# EAGLE schematic MotherBoard (EAGLE 8.1.0)

## Sheet 1 of 6
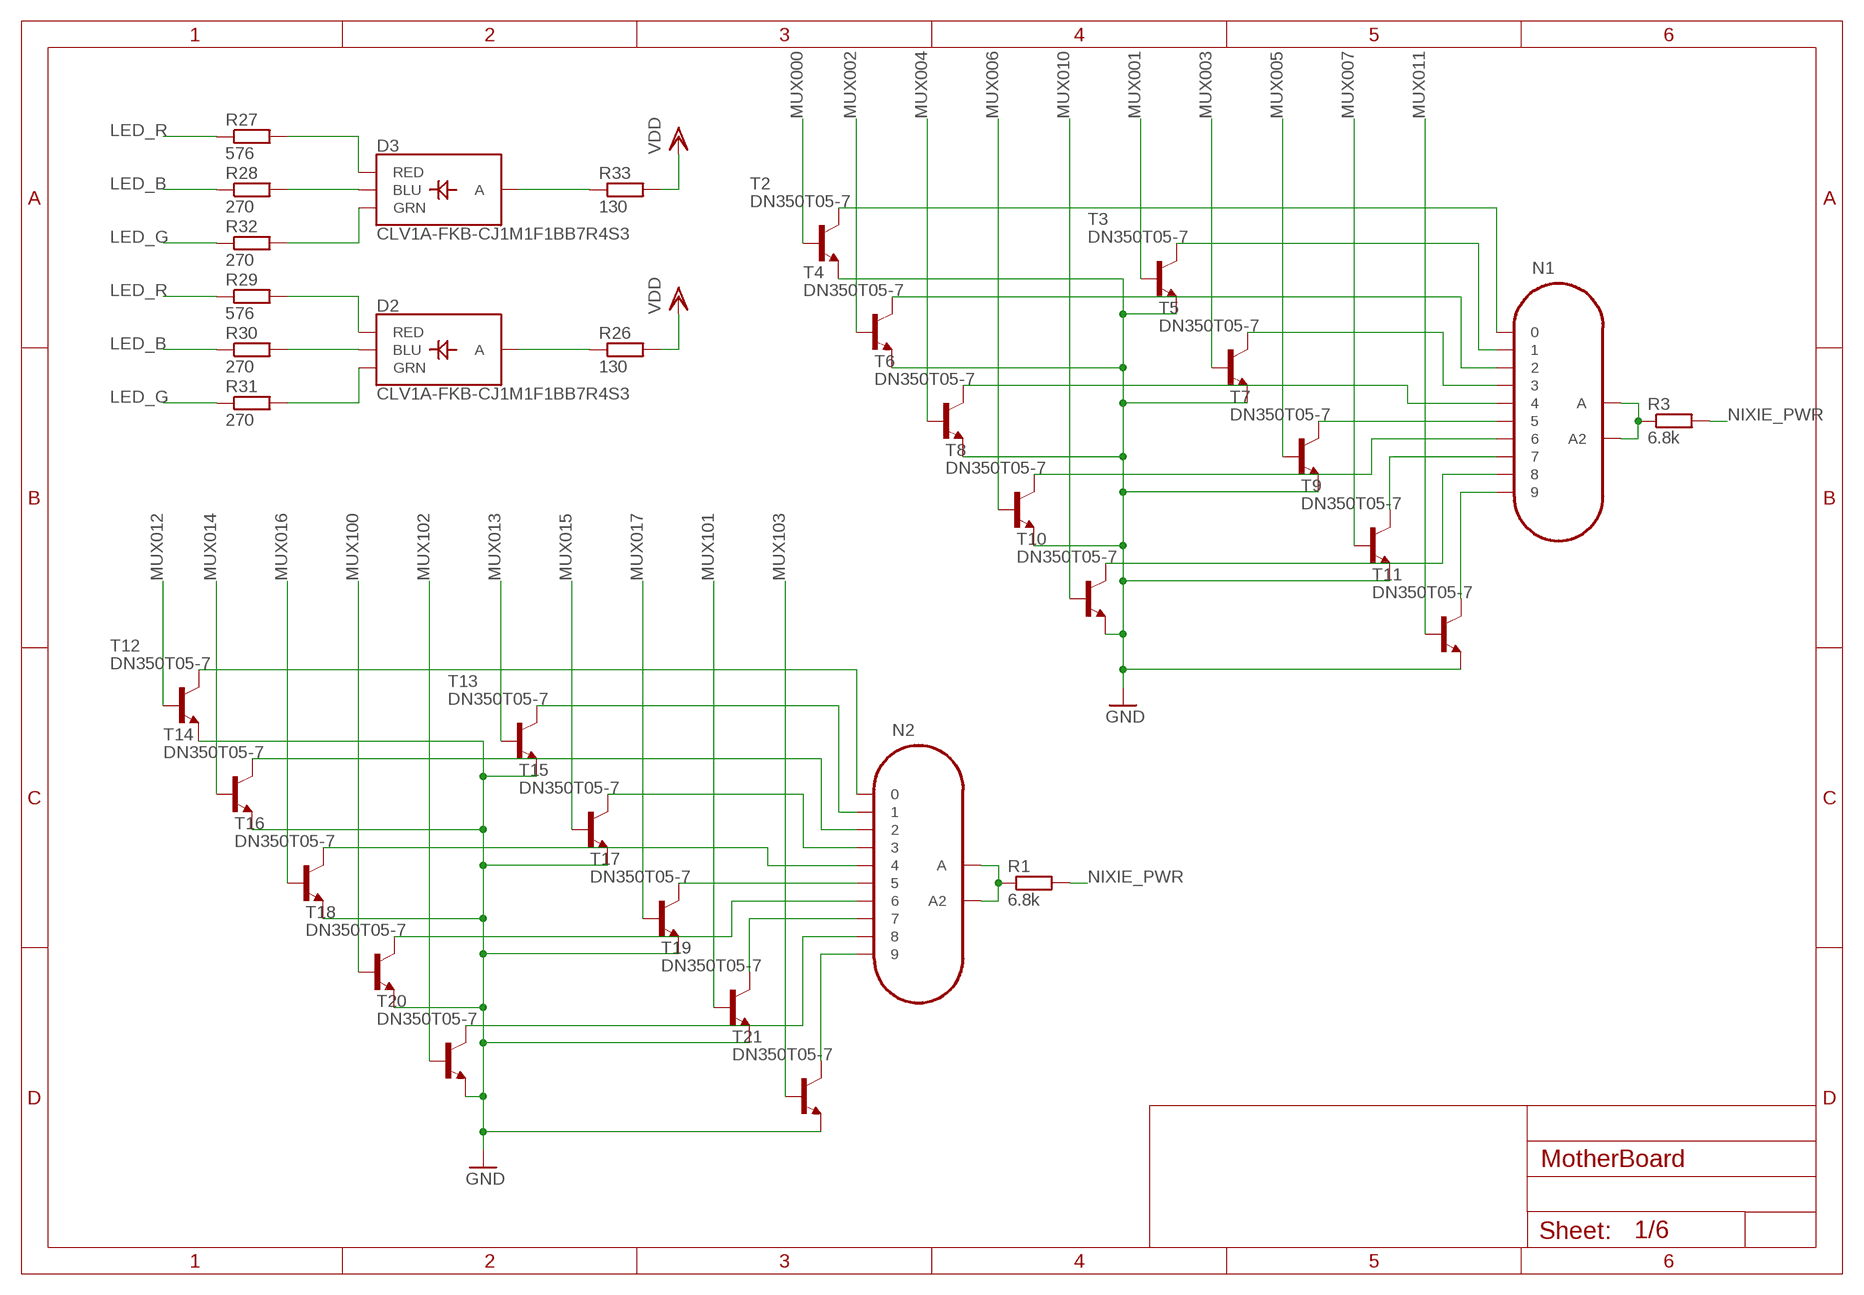
[diagram p0: schematic, sheet 1]

### Parts
D2  CLV1A-FKB-CJ1M1F1BB7R4S3  LED-RGB-CAPLCC  [P-LCC-4-3]
D3  CLV1A-FKB-CJ1M1F1BB7R4S3  LED-RGB-CAPLCC  [P-LCC-4-3]
N1  IN-18  [IN-18]
N2  IN-18  [IN-18]
R1  6.8k  R-EU_R0603  [R0603]
R3  6.8k  R-EU_R0603  [R0603]
R26  130  R-EU_R0603  [R0603]
R27  576  R-EU_R0603  [R0603]
R28  270  R-EU_R0603  [R0603]
R29  576  R-EU_R0603  [R0603]
R30  270  R-EU_R0603  [R0603]
R31  270  R-EU_R0603  [R0603]
R32  270  R-EU_R0603  [R0603]
R33  130  R-EU_R0603  [R0603]
T2  DN350T05-7  -NPN-SOT23-EBC  [SOT23-EBC]
T3  DN350T05-7  -NPN-SOT23-EBC  [SOT23-EBC]
T4  DN350T05-7  -NPN-SOT23-EBC  [SOT23-EBC]
T5  DN350T05-7  -NPN-SOT23-EBC  [SOT23-EBC]
T6  DN350T05-7  -NPN-SOT23-EBC  [SOT23-EBC]
T7  DN350T05-7  -NPN-SOT23-EBC  [SOT23-EBC]
T8  DN350T05-7  -NPN-SOT23-EBC  [SOT23-EBC]
T9  DN350T05-7  -NPN-SOT23-EBC  [SOT23-EBC]
T10  DN350T05-7  -NPN-SOT23-EBC  [SOT23-EBC]
T11  DN350T05-7  -NPN-SOT23-EBC  [SOT23-EBC]
T12  DN350T05-7  -NPN-SOT23-EBC  [SOT23-EBC]
T13  DN350T05-7  -NPN-SOT23-EBC  [SOT23-EBC]
T14  DN350T05-7  -NPN-SOT23-EBC  [SOT23-EBC]
T15  DN350T05-7  -NPN-SOT23-EBC  [SOT23-EBC]
T16  DN350T05-7  -NPN-SOT23-EBC  [SOT23-EBC]
T17  DN350T05-7  -NPN-SOT23-EBC  [SOT23-EBC]
T18  DN350T05-7  -NPN-SOT23-EBC  [SOT23-EBC]
T19  DN350T05-7  -NPN-SOT23-EBC  [SOT23-EBC]
T20  DN350T05-7  -NPN-SOT23-EBC  [SOT23-EBC]
T21  DN350T05-7  -NPN-SOT23-EBC  [SOT23-EBC]

### Nets
GND: T2.E T3.E T4.E T5.E T6.E T7.E T8.E T9.E T10.E T11.E T12.E T13.E T14.E T15.E T16.E T17.E T18.E T19.E T20.E T21.E ; also sheet 2,3,4,5,6
LED_B: R28.1 R30.1 ; also sheet 2,3,6
LED_G: R31.1 R32.1 ; also sheet 2,3,6
LED_R: R27.1 R29.1 ; also sheet 2,3,6
MUX000: T2.B ; also sheet 4
MUX001: T3.B ; also sheet 4
MUX002: T4.B ; also sheet 4
MUX003: T5.B ; also sheet 4
MUX004: T6.B ; also sheet 4
MUX005: T7.B ; also sheet 4
MUX006: T8.B ; also sheet 4
MUX007: T9.B ; also sheet 4
MUX010: T10.B ; also sheet 4
MUX011: T11.B ; also sheet 4
MUX012: T12.B ; also sheet 4
MUX013: T13.B ; also sheet 4
MUX014: T14.B ; also sheet 4
MUX015: T15.B ; also sheet 4
MUX016: T16.B ; also sheet 4
MUX017: T17.B ; also sheet 4
MUX100: T18.B ; also sheet 4
MUX101: T19.B ; also sheet 4
MUX102: T20.B ; also sheet 4
MUX103: T21.B ; also sheet 4
N$1 [HV]: N2.1 T13.C
N$2 [HV]: N2.2 T14.C
N$3 [HV]: N2.3 T15.C
N$4 [HV]: N2.4 T16.C
N$5: N1.A N1.A2 R3.1
N$6 [HV]: N1.1 T3.C
N$7 [HV]: N1.2 T4.C
N$8 [HV]: N1.3 T5.C
N$9 [HV]: N1.4 T6.C
N$10 [HV]: N1.5 T7.C
N$11 [HV]: N1.6 T8.C
N$12 [HV]: N2.5 T17.C
N$13 [HV]: N2.6 T18.C
N$14 [HV]: N1.7 T9.C
N$15 [HV]: N1.8 T10.C
N$16 [HV]: N1.9 T11.C
N$17 [HV]: N2.7 T19.C
N$18 [HV]: N2.0 T12.C
N$19 [HV]: N2.8 T20.C
N$20 [HV]: N2.9 T21.C
N$21: N2.A N2.A2 R1.1
N$24 [HV]: N1.0 T2.C
N$73: D2.4(A) R26.1
N$83: D2.1(RED) R29.2
N$84: D2.3(BLU) R30.2
N$85: D2.2(GRN) R31.2
N$86: D3.4(A) R33.1
N$87: D3.1(RED) R27.2
N$88: D3.3(BLU) R28.2
N$89: D3.2(GRN) R32.2
NIXIE_PWR: R1.2 R3.2 ; also sheet 2,3,5
VDD: R26.2 R33.2 ; also sheet 2,3,4,5,6

## Sheet 2 of 6
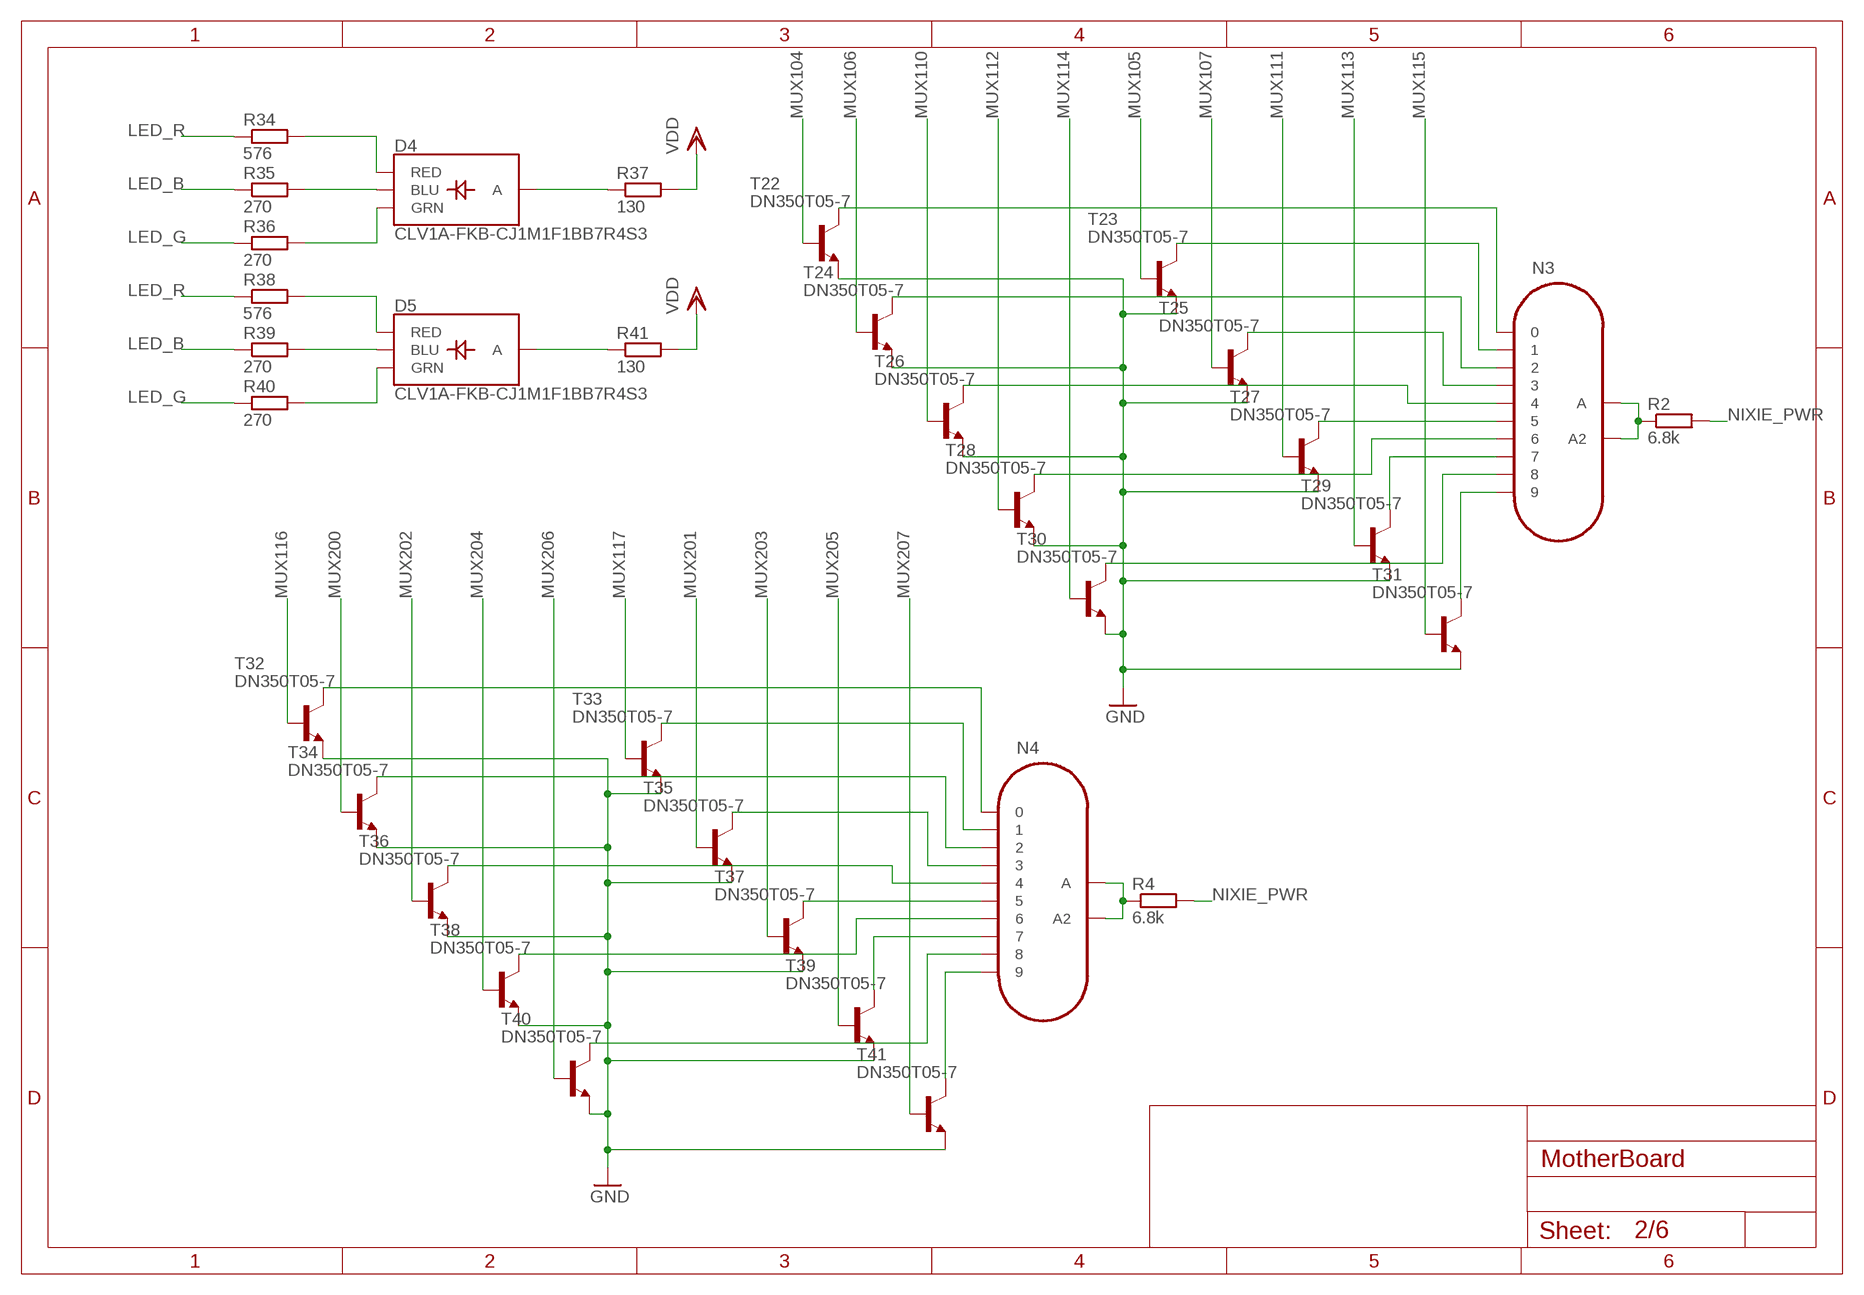
[diagram p1: schematic, sheet 2]

### Parts
D4  CLV1A-FKB-CJ1M1F1BB7R4S3  LED-RGB-CAPLCC  [P-LCC-4-3]
D5  CLV1A-FKB-CJ1M1F1BB7R4S3  LED-RGB-CAPLCC  [P-LCC-4-3]
N3  IN-18  [IN-18]
N4  IN-18  [IN-18]
R2  6.8k  R-EU_R0603  [R0603]
R4  6.8k  R-EU_R0603  [R0603]
R34  576  R-EU_R0603  [R0603]
R35  270  R-EU_R0603  [R0603]
R36  270  R-EU_R0603  [R0603]
R37  130  R-EU_R0603  [R0603]
R38  576  R-EU_R0603  [R0603]
R39  270  R-EU_R0603  [R0603]
R40  270  R-EU_R0603  [R0603]
R41  130  R-EU_R0603  [R0603]
T22  DN350T05-7  -NPN-SOT23-EBC  [SOT23-EBC]
T23  DN350T05-7  -NPN-SOT23-EBC  [SOT23-EBC]
T24  DN350T05-7  -NPN-SOT23-EBC  [SOT23-EBC]
T25  DN350T05-7  -NPN-SOT23-EBC  [SOT23-EBC]
T26  DN350T05-7  -NPN-SOT23-EBC  [SOT23-EBC]
T27  DN350T05-7  -NPN-SOT23-EBC  [SOT23-EBC]
T28  DN350T05-7  -NPN-SOT23-EBC  [SOT23-EBC]
T29  DN350T05-7  -NPN-SOT23-EBC  [SOT23-EBC]
T30  DN350T05-7  -NPN-SOT23-EBC  [SOT23-EBC]
T31  DN350T05-7  -NPN-SOT23-EBC  [SOT23-EBC]
T32  DN350T05-7  -NPN-SOT23-EBC  [SOT23-EBC]
T33  DN350T05-7  -NPN-SOT23-EBC  [SOT23-EBC]
T34  DN350T05-7  -NPN-SOT23-EBC  [SOT23-EBC]
T35  DN350T05-7  -NPN-SOT23-EBC  [SOT23-EBC]
T36  DN350T05-7  -NPN-SOT23-EBC  [SOT23-EBC]
T37  DN350T05-7  -NPN-SOT23-EBC  [SOT23-EBC]
T38  DN350T05-7  -NPN-SOT23-EBC  [SOT23-EBC]
T39  DN350T05-7  -NPN-SOT23-EBC  [SOT23-EBC]
T40  DN350T05-7  -NPN-SOT23-EBC  [SOT23-EBC]
T41  DN350T05-7  -NPN-SOT23-EBC  [SOT23-EBC]

### Nets
GND: T22.E T23.E T24.E T25.E T26.E T27.E T28.E T29.E T30.E T31.E T32.E T33.E T34.E T35.E T36.E T37.E T38.E T39.E T40.E T41.E ; also sheet 1,3,4,5,6
LED_B: R35.1 R39.1 ; also sheet 1,3,6
LED_G: R36.1 R40.1 ; also sheet 1,3,6
LED_R: R34.1 R38.1 ; also sheet 1,3,6
MUX104: T22.B ; also sheet 4
MUX105: T23.B ; also sheet 4
MUX106: T24.B ; also sheet 4
MUX107: T25.B ; also sheet 4
MUX110: T26.B ; also sheet 4
MUX111: T27.B ; also sheet 4
MUX112: T28.B ; also sheet 4
MUX113: T29.B ; also sheet 4
MUX114: T30.B ; also sheet 4
MUX115: T31.B ; also sheet 4
MUX116: T32.B ; also sheet 4
MUX117: T33.B ; also sheet 4
MUX200: T34.B ; also sheet 4
MUX201: T35.B ; also sheet 4
MUX202: T36.B ; also sheet 4
MUX203: T37.B ; also sheet 4
MUX204: T38.B ; also sheet 4
MUX205: T39.B ; also sheet 4
MUX206: T40.B ; also sheet 4
MUX207: T41.B ; also sheet 4
N$22 [HV]: N3.1 T23.C
N$23 [HV]: N3.2 T24.C
N$25 [HV]: N3.3 T25.C
N$26 [HV]: N3.4 T26.C
N$27 [HV]: N3.5 T27.C
N$28 [HV]: N3.6 T28.C
N$29 [HV]: N3.7 T29.C
N$30 [HV]: N3.0 T22.C
N$31 [HV]: N3.8 T30.C
N$32 [HV]: N3.9 T31.C
N$33: N3.A N3.A2 R2.1
N$34 [HV]: N4.1 T33.C
N$35 [HV]: N4.2 T34.C
N$36 [HV]: N4.3 T35.C
N$37 [HV]: N4.4 T36.C
N$38 [HV]: N4.5 T37.C
N$39 [HV]: N4.6 T38.C
N$40 [HV]: N4.7 T39.C
N$41 [HV]: N4.0 T32.C
N$42 [HV]: N4.8 T40.C
N$43 [HV]: N4.9 T41.C
N$44: N4.A N4.A2 R4.1
N$90: D4.4(A) R37.1
N$91: D4.1(RED) R34.2
N$92: D4.3(BLU) R35.2
N$93: D4.2(GRN) R36.2
N$94: D5.4(A) R41.1
N$95: D5.1(RED) R38.2
N$96: D5.3(BLU) R39.2
N$97: D5.2(GRN) R40.2
NIXIE_PWR: R2.2 R4.2 ; also sheet 1,3,5
VDD: R37.2 R41.2 ; also sheet 1,3,4,5,6

## Sheet 3 of 6
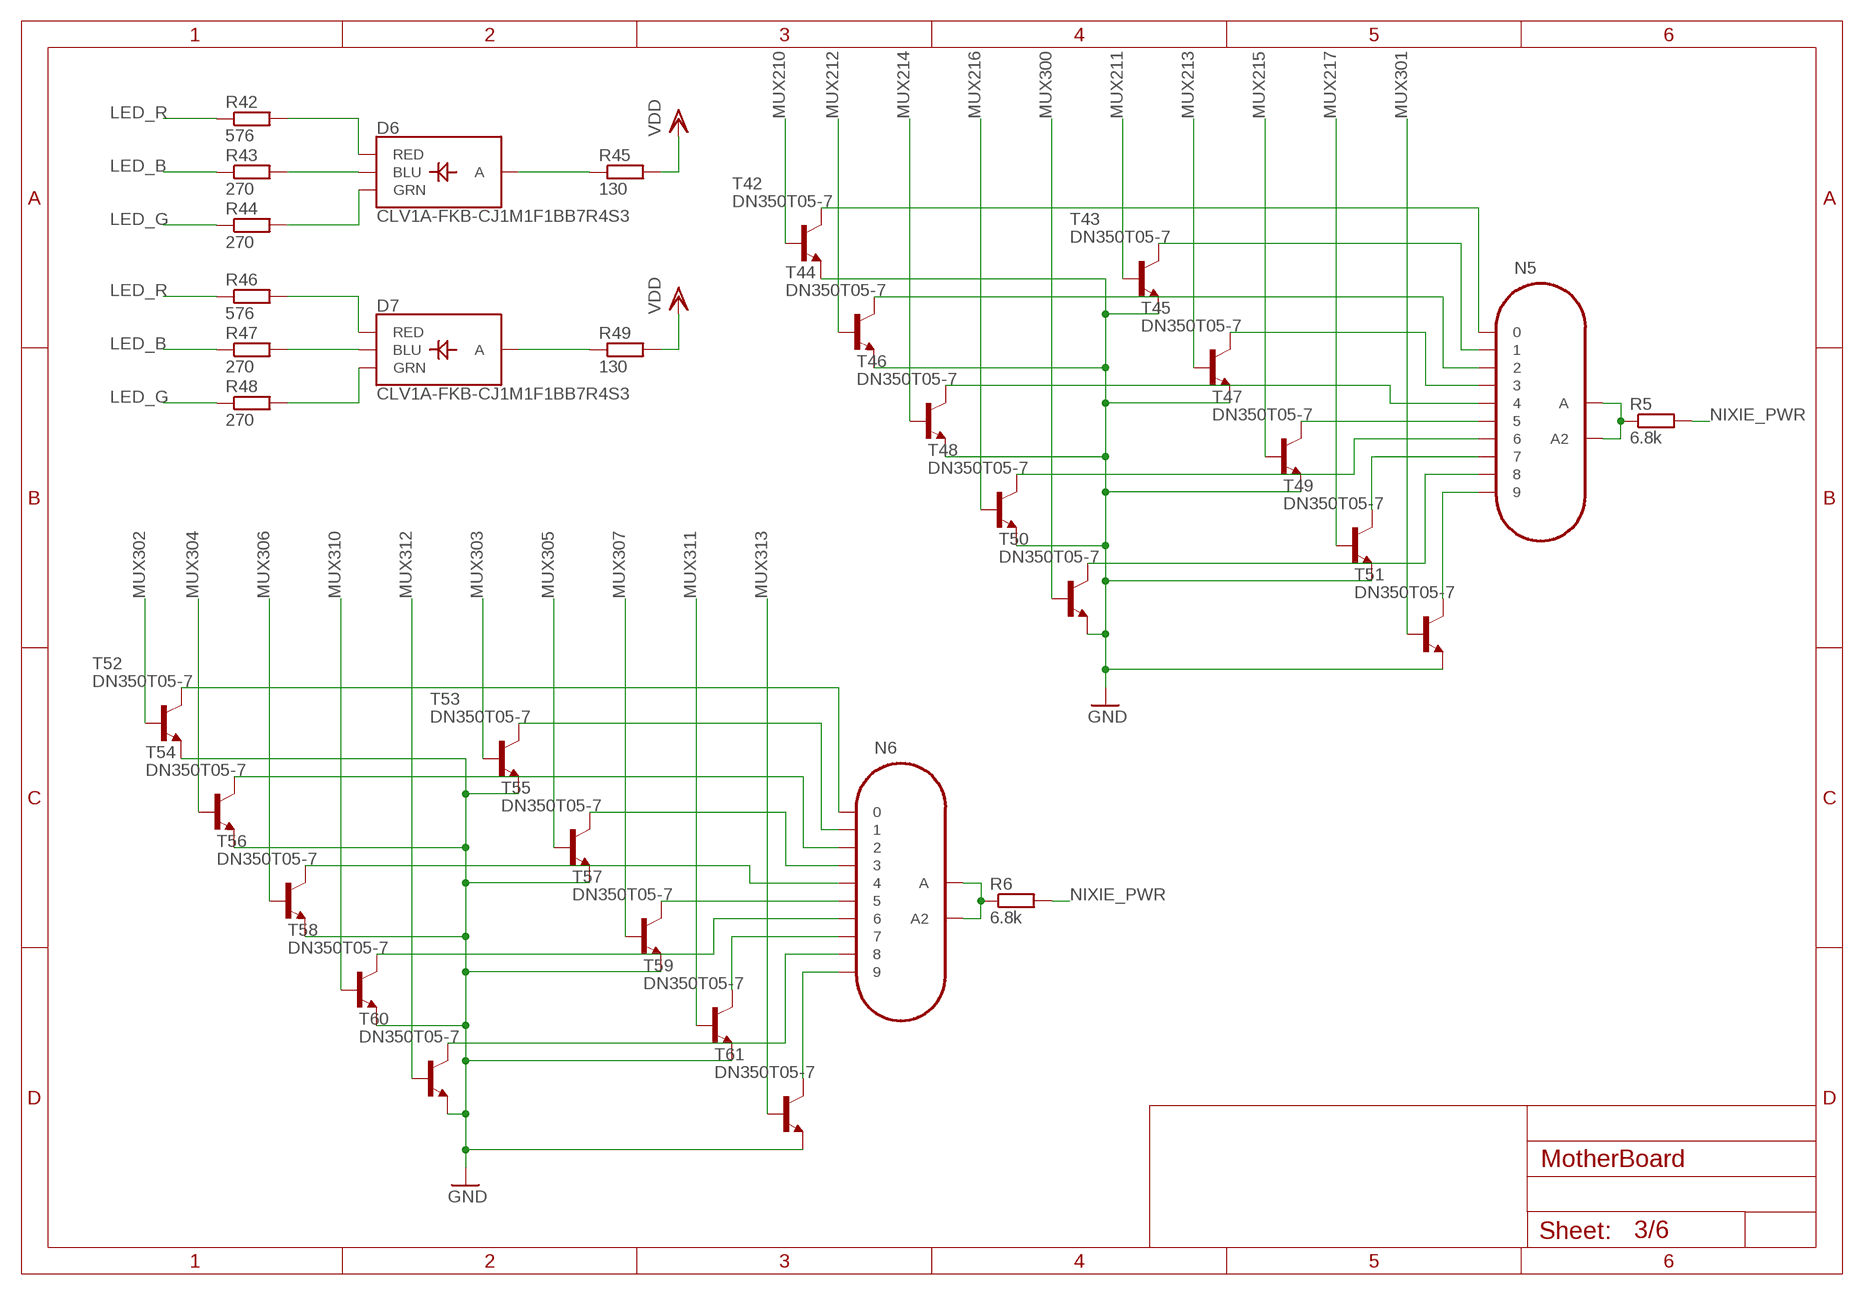
[diagram p2: schematic, sheet 3]

### Parts
D6  CLV1A-FKB-CJ1M1F1BB7R4S3  LED-RGB-CAPLCC  [P-LCC-4-3]
D7  CLV1A-FKB-CJ1M1F1BB7R4S3  LED-RGB-CAPLCC  [P-LCC-4-3]
N5  IN-18  [IN-18]
N6  IN-18  [IN-18]
R5  6.8k  R-EU_R0603  [R0603]
R6  6.8k  R-EU_R0603  [R0603]
R42  576  R-EU_R0603  [R0603]
R43  270  R-EU_R0603  [R0603]
R44  270  R-EU_R0603  [R0603]
R45  130  R-EU_R0603  [R0603]
R46  576  R-EU_R0603  [R0603]
R47  270  R-EU_R0603  [R0603]
R48  270  R-EU_R0603  [R0603]
R49  130  R-EU_R0603  [R0603]
T42  DN350T05-7  -NPN-SOT23-EBC  [SOT23-EBC]
T43  DN350T05-7  -NPN-SOT23-EBC  [SOT23-EBC]
T44  DN350T05-7  -NPN-SOT23-EBC  [SOT23-EBC]
T45  DN350T05-7  -NPN-SOT23-EBC  [SOT23-EBC]
T46  DN350T05-7  -NPN-SOT23-EBC  [SOT23-EBC]
T47  DN350T05-7  -NPN-SOT23-EBC  [SOT23-EBC]
T48  DN350T05-7  -NPN-SOT23-EBC  [SOT23-EBC]
T49  DN350T05-7  -NPN-SOT23-EBC  [SOT23-EBC]
T50  DN350T05-7  -NPN-SOT23-EBC  [SOT23-EBC]
T51  DN350T05-7  -NPN-SOT23-EBC  [SOT23-EBC]
T52  DN350T05-7  -NPN-SOT23-EBC  [SOT23-EBC]
T53  DN350T05-7  -NPN-SOT23-EBC  [SOT23-EBC]
T54  DN350T05-7  -NPN-SOT23-EBC  [SOT23-EBC]
T55  DN350T05-7  -NPN-SOT23-EBC  [SOT23-EBC]
T56  DN350T05-7  -NPN-SOT23-EBC  [SOT23-EBC]
T57  DN350T05-7  -NPN-SOT23-EBC  [SOT23-EBC]
T58  DN350T05-7  -NPN-SOT23-EBC  [SOT23-EBC]
T59  DN350T05-7  -NPN-SOT23-EBC  [SOT23-EBC]
T60  DN350T05-7  -NPN-SOT23-EBC  [SOT23-EBC]
T61  DN350T05-7  -NPN-SOT23-EBC  [SOT23-EBC]

### Nets
GND: T42.E T43.E T44.E T45.E T46.E T47.E T48.E T49.E T50.E T51.E T52.E T53.E T54.E T55.E T56.E T57.E T58.E T59.E T60.E T61.E ; also sheet 1,2,4,5,6
LED_B: R43.1 R47.1 ; also sheet 1,2,6
LED_G: R44.1 R48.1 ; also sheet 1,2,6
LED_R: R42.1 R46.1 ; also sheet 1,2,6
MUX210: T42.B ; also sheet 4
MUX211: T43.B ; also sheet 4
MUX212: T44.B ; also sheet 4
MUX213: T45.B ; also sheet 4
MUX214: T46.B ; also sheet 4
MUX215: T47.B ; also sheet 4
MUX216: T48.B ; also sheet 4
MUX217: T49.B ; also sheet 4
MUX300: T50.B ; also sheet 4
MUX301: T51.B ; also sheet 4
MUX302: T52.B ; also sheet 4
MUX303: T53.B ; also sheet 4
MUX304: T54.B ; also sheet 4
MUX305: T55.B ; also sheet 4
MUX306: T56.B ; also sheet 4
MUX307: T57.B ; also sheet 4
MUX310: T58.B ; also sheet 4
MUX311: T59.B ; also sheet 4
MUX312: T60.B ; also sheet 4
MUX313: T61.B ; also sheet 4
N$45 [HV]: N5.1 T43.C
N$46 [HV]: N5.2 T44.C
N$47 [HV]: N5.3 T45.C
N$48 [HV]: N5.4 T46.C
N$49 [HV]: N5.5 T47.C
N$50 [HV]: N5.6 T48.C
N$51 [HV]: N5.7 T49.C
N$52 [HV]: N5.0 T42.C
N$53 [HV]: N5.8 T50.C
N$54 [HV]: N5.9 T51.C
N$55: N5.A N5.A2 R5.1
N$56 [HV]: N6.1 T53.C
N$57 [HV]: N6.2 T54.C
N$58 [HV]: N6.3 T55.C
N$59 [HV]: N6.4 T56.C
N$60 [HV]: N6.5 T57.C
N$61 [HV]: N6.6 T58.C
N$62 [HV]: N6.7 T59.C
N$63 [HV]: N6.0 T52.C
N$64 [HV]: N6.8 T60.C
N$65 [HV]: N6.9 T61.C
N$66: N6.A N6.A2 R6.1
N$98: D6.4(A) R45.1
N$99: D6.1(RED) R42.2
N$100: D6.3(BLU) R43.2
N$101: D6.2(GRN) R44.2
N$102: D7.4(A) R49.1
N$103: D7.1(RED) R46.2
N$104: D7.3(BLU) R47.2
N$105: D7.2(GRN) R48.2
NIXIE_PWR: R5.2 R6.2 ; also sheet 1,2,5
VDD: R45.2 R49.2 ; also sheet 1,2,4,5,6

## Sheet 4 of 6
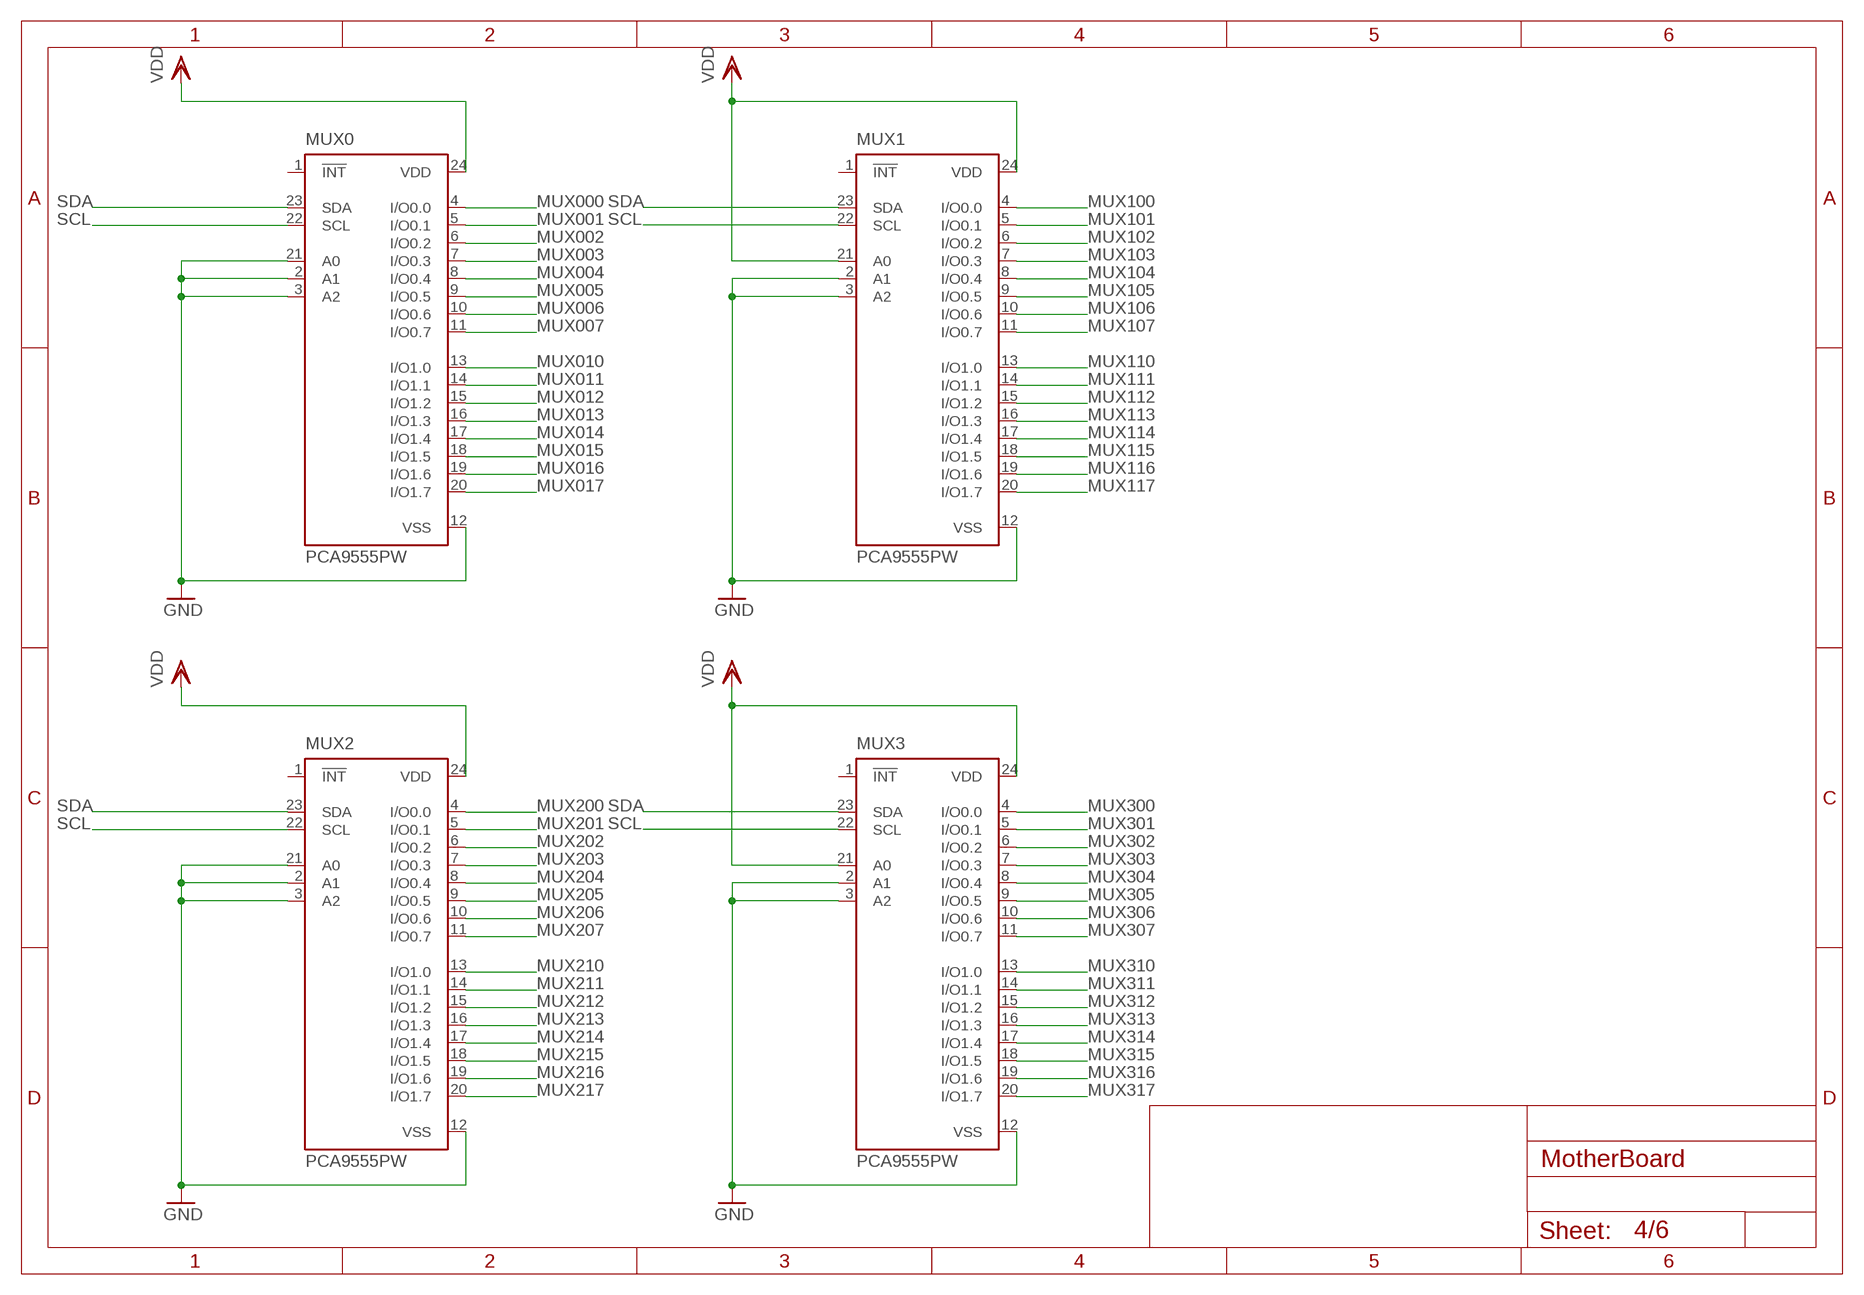
[diagram p3: schematic, sheet 4]

### Parts
MUX0  PCA9555PW  [TSSOP24]
MUX1  PCA9555PW  [TSSOP24]
MUX2  PCA9555PW  [TSSOP24]
MUX3  PCA9555PW  [TSSOP24]

### Nets
GND: MUX0.2(A1) MUX0.3(A2) MUX0.12(VSS) MUX0.21(A0) MUX1.2(A1) MUX1.3(A2) MUX1.12(VSS) MUX2.2(A1) MUX2.3(A2) MUX2.12(VSS) MUX2.21(A0) MUX3.2(A1) MUX3.3(A2) MUX3.12(VSS) ; also sheet 1,2,3,5,6
MUX000: MUX0.4(I/O0.0) ; also sheet 1
MUX001: MUX0.5(I/O0.1) ; also sheet 1
MUX002: MUX0.6(I/O0.2) ; also sheet 1
MUX003: MUX0.7(I/O0.3) ; also sheet 1
MUX004: MUX0.8(I/O0.4) ; also sheet 1
MUX005: MUX0.9(I/O0.5) ; also sheet 1
MUX006: MUX0.10(I/O0.6) ; also sheet 1
MUX007: MUX0.11(I/O0.7) ; also sheet 1
MUX010: MUX0.13(I/O1.0) ; also sheet 1
MUX011: MUX0.14(I/O1.1) ; also sheet 1
MUX012: MUX0.15(I/O1.2) ; also sheet 1
MUX013: MUX0.16(I/O1.3) ; also sheet 1
MUX014: MUX0.17(I/O1.4) ; also sheet 1
MUX015: MUX0.18(I/O1.5) ; also sheet 1
MUX016: MUX0.19(I/O1.6) ; also sheet 1
MUX017: MUX0.20(I/O1.7) ; also sheet 1
MUX100: MUX1.4(I/O0.0) ; also sheet 1
MUX101: MUX1.5(I/O0.1) ; also sheet 1
MUX102: MUX1.6(I/O0.2) ; also sheet 1
MUX103: MUX1.7(I/O0.3) ; also sheet 1
MUX104: MUX1.8(I/O0.4) ; also sheet 2
MUX105: MUX1.9(I/O0.5) ; also sheet 2
MUX106: MUX1.10(I/O0.6) ; also sheet 2
MUX107: MUX1.11(I/O0.7) ; also sheet 2
MUX110: MUX1.13(I/O1.0) ; also sheet 2
MUX111: MUX1.14(I/O1.1) ; also sheet 2
MUX112: MUX1.15(I/O1.2) ; also sheet 2
MUX113: MUX1.16(I/O1.3) ; also sheet 2
MUX114: MUX1.17(I/O1.4) ; also sheet 2
MUX115: MUX1.18(I/O1.5) ; also sheet 2
MUX116: MUX1.19(I/O1.6) ; also sheet 2
MUX117: MUX1.20(I/O1.7) ; also sheet 2
MUX200: MUX2.4(I/O0.0) ; also sheet 2
MUX201: MUX2.5(I/O0.1) ; also sheet 2
MUX202: MUX2.6(I/O0.2) ; also sheet 2
MUX203: MUX2.7(I/O0.3) ; also sheet 2
MUX204: MUX2.8(I/O0.4) ; also sheet 2
MUX205: MUX2.9(I/O0.5) ; also sheet 2
MUX206: MUX2.10(I/O0.6) ; also sheet 2
MUX207: MUX2.11(I/O0.7) ; also sheet 2
MUX210: MUX2.13(I/O1.0) ; also sheet 3
MUX211: MUX2.14(I/O1.1) ; also sheet 3
MUX212: MUX2.15(I/O1.2) ; also sheet 3
MUX213: MUX2.16(I/O1.3) ; also sheet 3
MUX214: MUX2.17(I/O1.4) ; also sheet 3
MUX215: MUX2.18(I/O1.5) ; also sheet 3
MUX216: MUX2.19(I/O1.6) ; also sheet 3
MUX217: MUX2.20(I/O1.7) ; also sheet 3
MUX300: MUX3.4(I/O0.0) ; also sheet 3
MUX301: MUX3.5(I/O0.1) ; also sheet 3
MUX302: MUX3.6(I/O0.2) ; also sheet 3
MUX303: MUX3.7(I/O0.3) ; also sheet 3
MUX304: MUX3.8(I/O0.4) ; also sheet 3
MUX305: MUX3.9(I/O0.5) ; also sheet 3
MUX306: MUX3.10(I/O0.6) ; also sheet 3
MUX307: MUX3.11(I/O0.7) ; also sheet 3
MUX310: MUX3.13(I/O1.0) ; also sheet 3
MUX311: MUX3.14(I/O1.1) ; also sheet 3
MUX312: MUX3.15(I/O1.2) ; also sheet 3
MUX313: MUX3.16(I/O1.3) ; also sheet 3
MUX314: MUX3.17(I/O1.4)
MUX315: MUX3.18(I/O1.5)
MUX316: MUX3.19(I/O1.6)
MUX317: MUX3.20(I/O1.7)
SCL: MUX0.22(SCL) MUX1.22(SCL) MUX2.22(SCL) MUX3.22(SCL) ; also sheet 6
SDA: MUX0.23(SDA) MUX1.23(SDA) MUX2.23(SDA) MUX3.23(SDA) ; also sheet 6
VDD: MUX0.24(VDD) MUX1.21(A0) MUX1.24(VDD) MUX2.24(VDD) MUX3.21(A0) MUX3.24(VDD) ; also sheet 1,2,3,5,6
Unconnected: MUX0.1(!INT) MUX1.1(!INT) MUX2.1(!INT) MUX3.1(!INT)

## Sheet 5 of 6
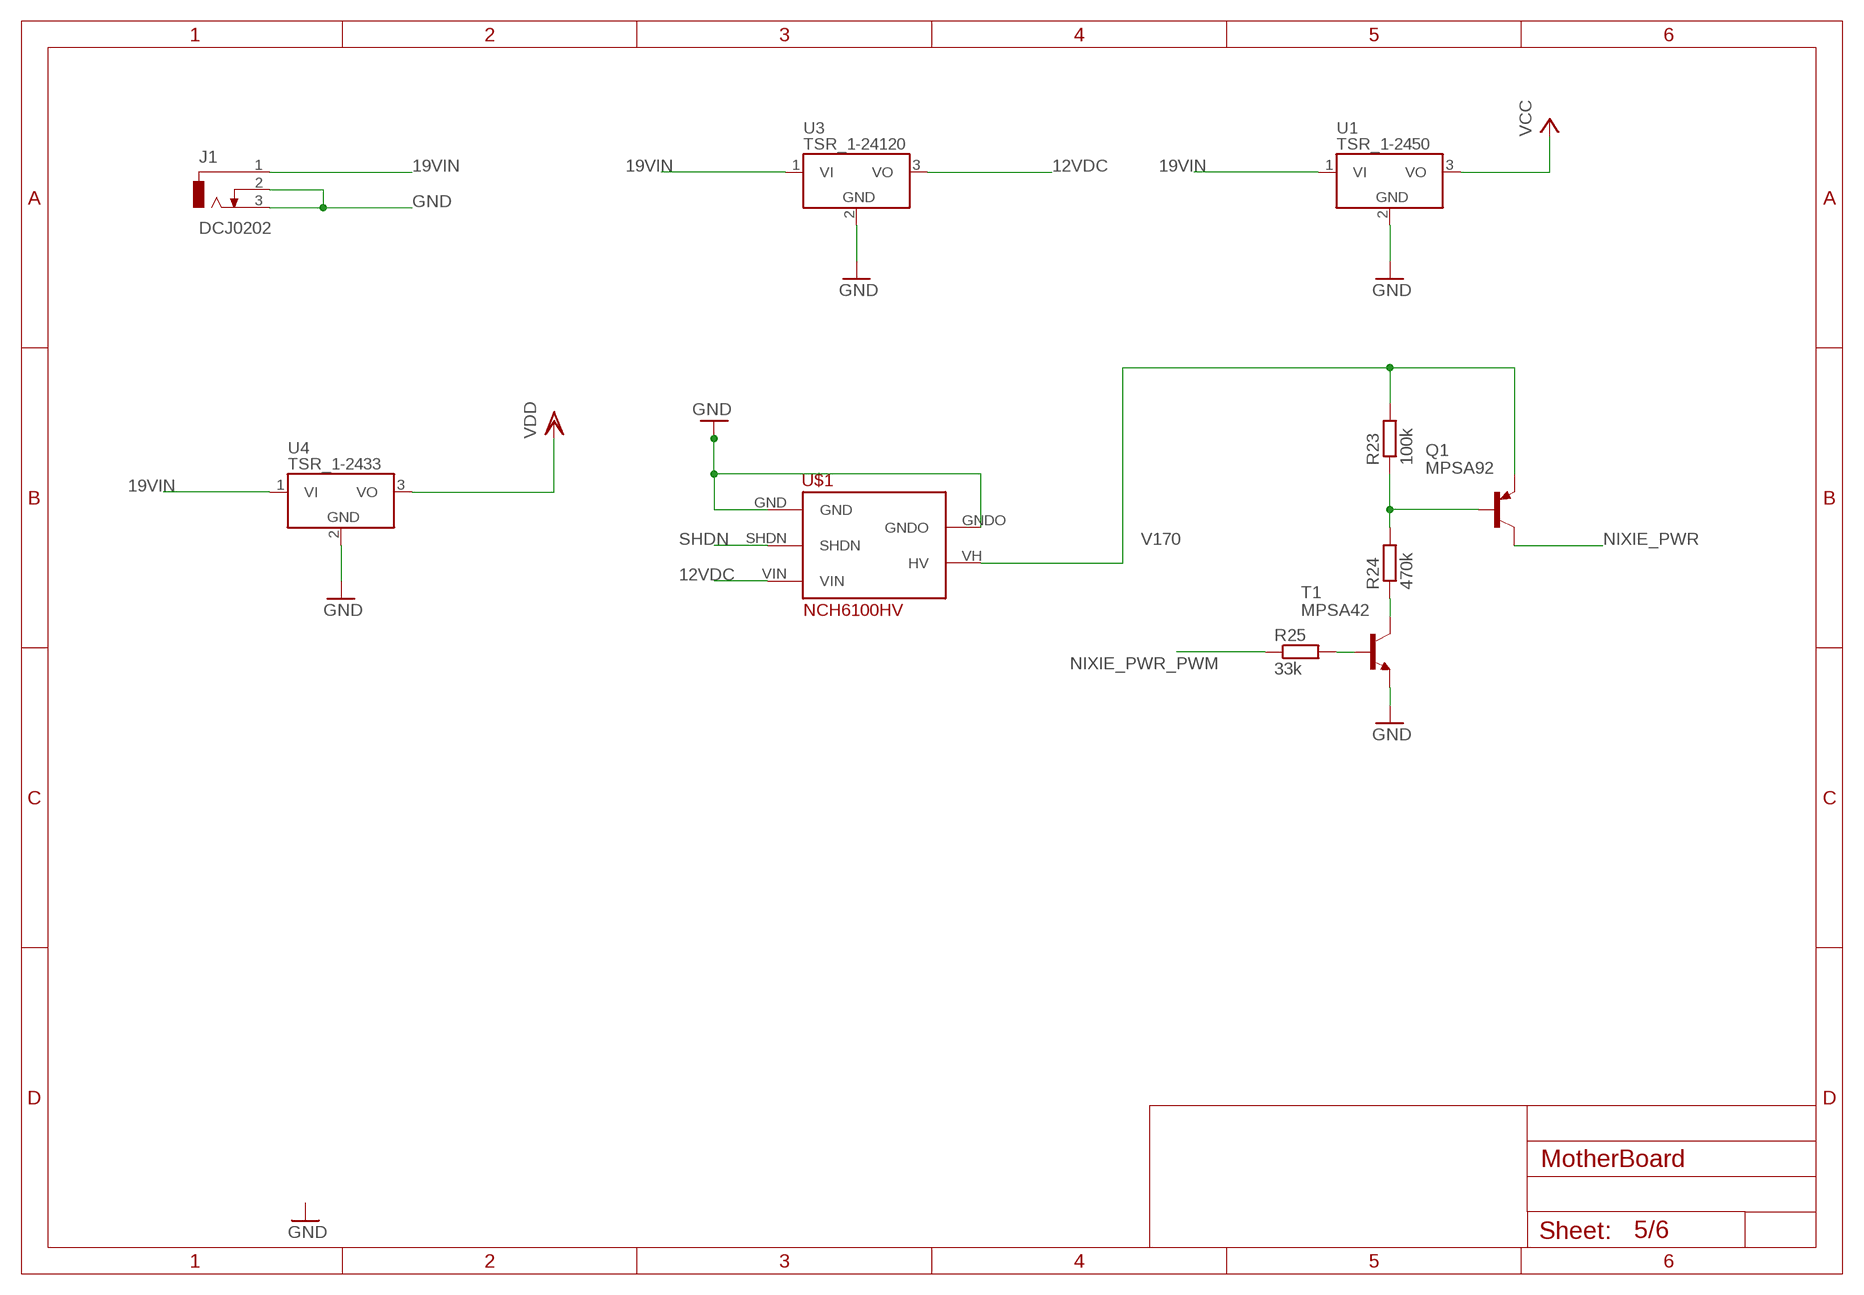
[diagram p4: schematic, sheet 5]

### Parts
J1  DCJ0202  [DCJ0202]
Q1  MPSA92  MMBTA56-SOT23  [SOT23]
R23  100k  R-EU_R0603  [R0603]
R24  470k  R-EU_R0603  [R0603]
R25  33k  R-EU_R0603  [R0603]
T1  MPSA42  MMBTA42LT1-NPN-SOT23-BEC  [SOT23-BEC]
U1  TSR_1-2450  [TSR-1]
U3  TSR_1-24120  [TSR-1]
U4  TSR_1-2433  [TSR-1]
U$1  NCH6100HV  [NCH6100-STD]

### Nets
12VDC: U3.3(VO) U$1.VIN
19VIN: J1.1 U1.1(VI) U3.1(VI) U4.1(VI)
GND: J1.2 J1.3 T1.E U1.2(GND) U3.2(GND) U4.2(GND) U$1.GND U$1.GNDO ; also sheet 1,2,3,4,6
N$70: Q1.1(B) R23.1 R24.2
N$71: R24.1 T1.C
N$72: R25.2 T1.B
NIXIE_PWR: Q1.3(C) ; also sheet 1,2,3
NIXIE_PWR_PWM: R25.1 ; also sheet 6
SHDN: U$1.SHDN ; also sheet 6
V170 [HV]: Q1.2(E) R23.2 U$1.VH(HV)
VCC: U1.3(VO) ; also sheet 6
VDD: U4.3(VO) ; also sheet 1,2,3,4,6

## Sheet 6 of 6
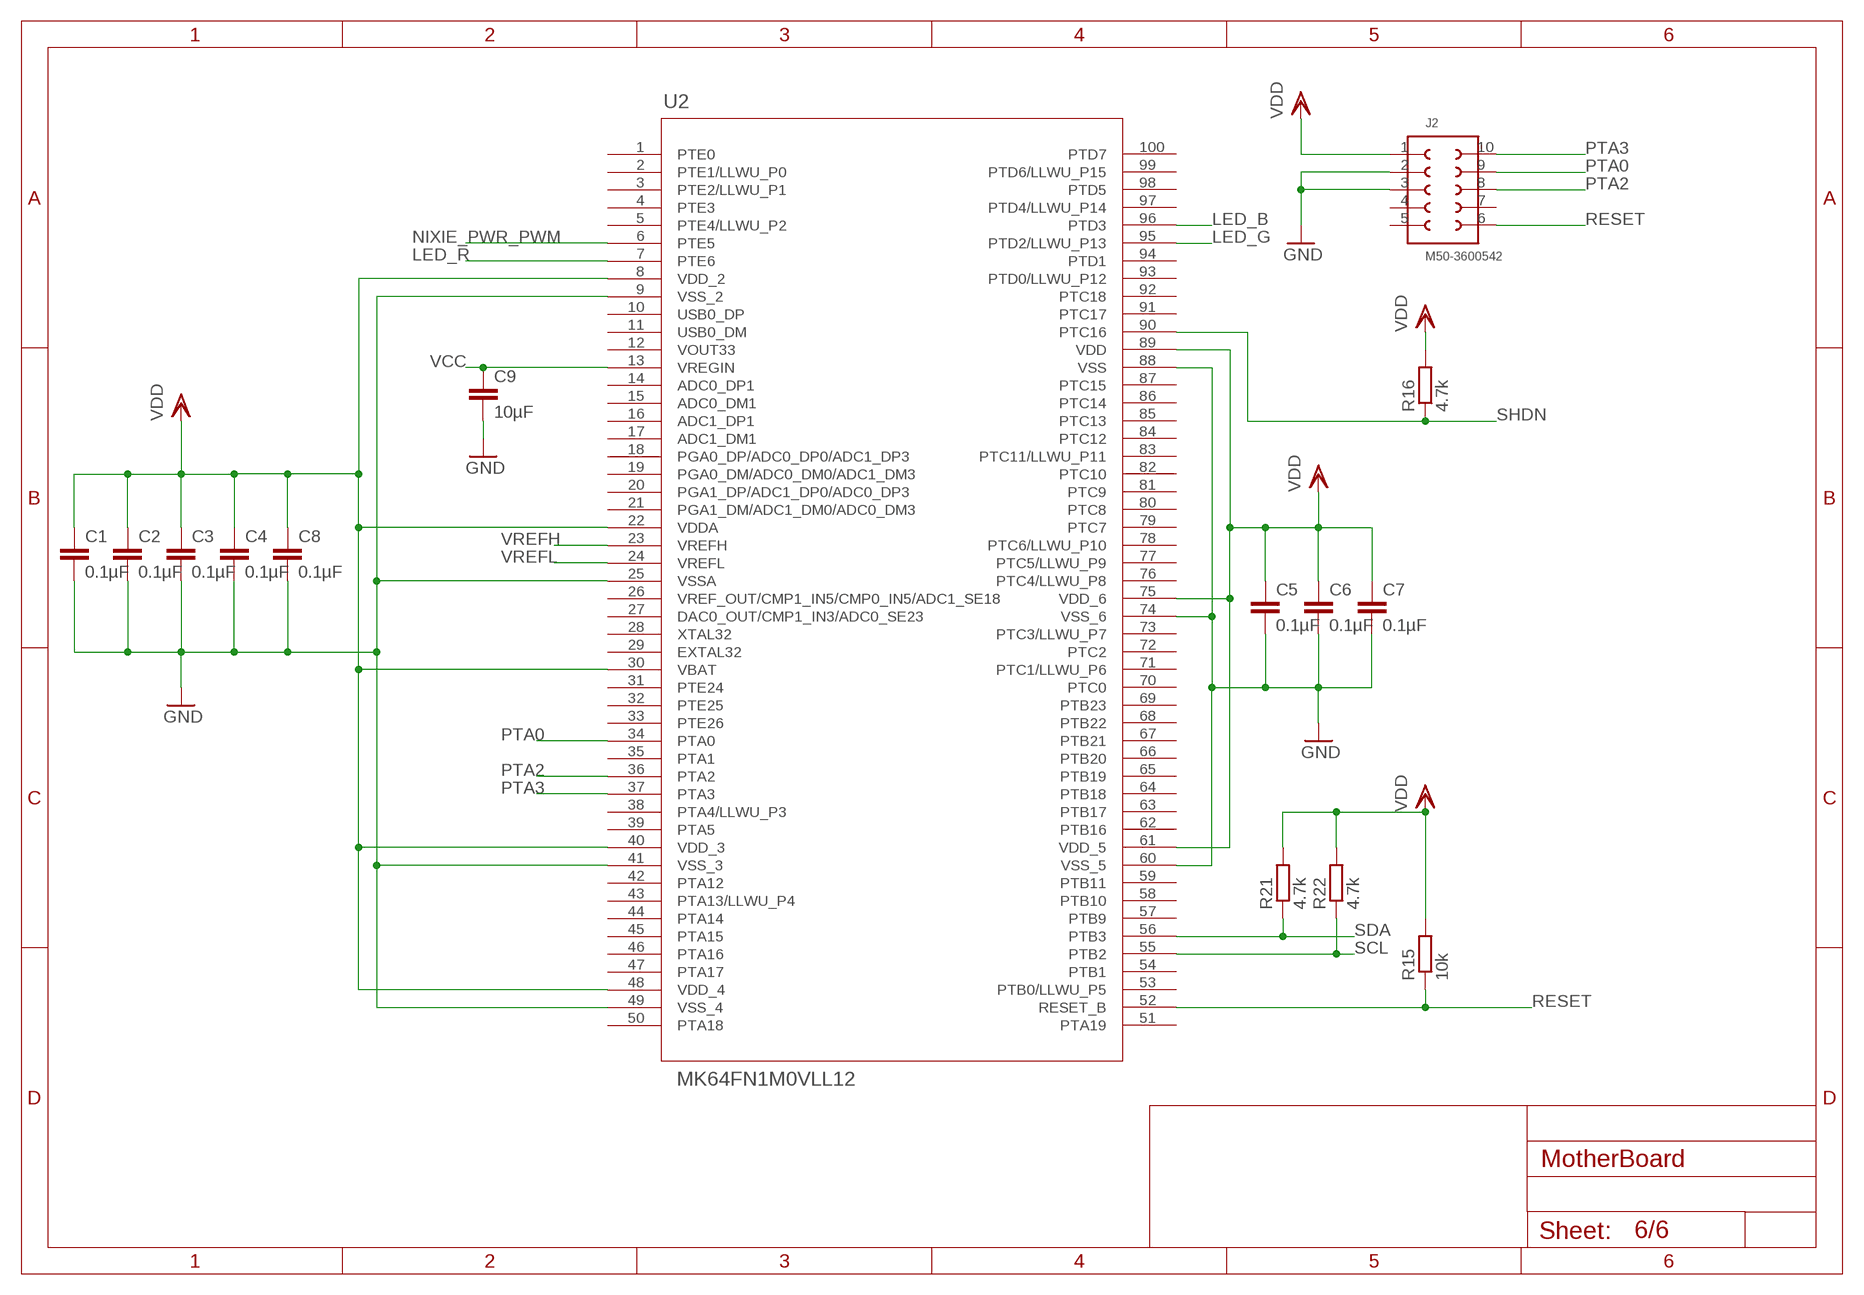
[diagram p5: schematic, sheet 6]

### Parts
C1  0.1µF  C-EUC0603  [C0603]
C2  0.1µF  C-EUC0603  [C0603]
C3  0.1µF  C-EUC0603  [C0603]
C4  0.1µF  C-EUC0603  [C0603]
C5  0.1µF  C-EUC0603  [C0603]
C6  0.1µF  C-EUC0603  [C0603]
C7  0.1µF  C-EUC0603  [C0603]
C8  0.1µF  C-EUC0603  [C0603]
C9  10µF  C-EUC0603  [C0603]
J2  M50-3600542  621X1021021  [621X1021021]
R15  10k  R-EU_R0603  [R0603]
R16  4.7k  R-EU_R0603  [R0603]
R21  4.7k  R-EU_R0603  [R0603]
R22  4.7k  R-EU_R0603  [R0603]
U2  MK64FN1M0VLL12  [LQFP-100_14X14X1.7]

### Nets
GND: C1.2 C2.2 C3.2 C4.2 C5.2 C6.2 C7.2 C8.2 C9.2 J2.2 J2.3 U2.9(VSS_2) U2.25(VSSA) U2.41(VSS_3) U2.49(VSS_4) U2.60(VSS_5) U2.74(VSS_6) U2.88(VSS) ; also sheet 1,2,3,4,5
LED_B: U2.96(PTD3) ; also sheet 1,2,3
LED_G: U2.95(PTD2/LLWU_P13) ; also sheet 1,2,3
LED_R: U2.7(PTE6) ; also sheet 1,2,3
NIXIE_PWR_PWM: U2.6(PTE5) ; also sheet 5
PTA0: J2.9 U2.34(PTA0)
PTA2: J2.8 U2.36(PTA2)
PTA3: J2.10 U2.37(PTA3)
RESET: J2.6 R15.1 U2.52(RESET_B)
SCL: R22.1 U2.55(PTB2) ; also sheet 4
SDA: R21.1 U2.56(PTB3) ; also sheet 4
SHDN: R16.1 U2.90(PTC16) ; also sheet 5
VCC: C9.1 U2.13(VREGIN) ; also sheet 5
VDD: C1.1 C2.1 C3.1 C4.1 C5.1 C6.1 C7.1 C8.1 J2.1 R15.2 R16.2 R21.2 R22.2 U2.8(VDD_2) U2.22(VDDA) U2.30(VBAT) U2.40(VDD_3) U2.48(VDD_4) U2.61(VDD_5) U2.75(VDD_6) U2.89(VDD) ; also sheet 1,2,3,4,5
VREFH: U2.23(VREFH)
VREFL: U2.24(VREFL)
Unconnected: J2.4 J2.5 J2.7 U2.1(PTE0) U2.2(PTE1/LLWU_P0) U2.3(PTE2/LLWU_P1) U2.4(PTE3) U2.5(PTE4/LLWU_P2) U2.10(USB0_DP) U2.11(USB0_DM) U2.12(VOUT33) U2.14(ADC0_DP1) U2.15(ADC0_DM1) U2.16(ADC1_DP1) U2.17(ADC1_DM1) U2.18(PGA0_DP/ADC0_DP0/ADC1_DP3) U2.19(PGA0_DM/ADC0_DM0/ADC1_DM3) U2.20(PGA1_DP/ADC1_DP0/ADC0_DP3) U2.21(PGA1_DM/ADC1_DM0/ADC0_DM3) U2.26(VREF_OUT/CMP1_IN5/CMP0_IN5/ADC1_SE18) U2.27(DAC0_OUT/CMP1_IN3/ADC0_SE23) U2.28(XTAL32) U2.29(EXTAL32) U2.31(PTE24) U2.32(PTE25) U2.33(PTE26) U2.35(PTA1) U2.38(PTA4/LLWU_P3) U2.39(PTA5) U2.42(PTA12) U2.43(PTA13/LLWU_P4) U2.44(PTA14) U2.45(PTA15) U2.46(PTA16) U2.47(PTA17) U2.50(PTA18) U2.51(PTA19) U2.53(PTB0/LLWU_P5) U2.54(PTB1) U2.57(PTB9) U2.58(PTB10) U2.59(PTB11) U2.62(PTB16) U2.63(PTB17) U2.64(PTB18) U2.65(PTB19) U2.66(PTB20) U2.67(PTB21) U2.68(PTB22) U2.69(PTB23) U2.70(PTC0) U2.71(PTC1/LLWU_P6) U2.72(PTC2) U2.73(PTC3/LLWU_P7) U2.76(PTC4/LLWU_P8) U2.77(PTC5/LLWU_P9) U2.78(PTC6/LLWU_P10) U2.79(PTC7) U2.80(PTC8) U2.81(PTC9) U2.82(PTC10) U2.83(PTC11/LLWU_P11) U2.84(PTC12) U2.85(PTC13) U2.86(PTC14) U2.87(PTC15) U2.91(PTC17) U2.92(PTC18) U2.93(PTD0/LLWU_P12) U2.94(PTD1) U2.97(PTD4/LLWU_P14) U2.98(PTD5) U2.99(PTD6/LLWU_P15) U2.100(PTD7)

## Library data of the parts
C1-C9 = resistor:C-EU: CAPACITOR, European symbol
D2-D7 = SparkFun-LED:LED-RGB-CA: LED-RGB Diffused Common Anode Packages: LED RGB-THRU P-LCC-4-3 LED-TRICOLOR-SMD SparkFun Products: RGB Diffused Common Anode- Diffuse <[https://www.sparkfun.com/products/10821]> RGB Diffused Common Anode - Clear <[https://www.sparkfun.com/products/10820]> Qduino Mini <[https://www.sparkfun.com/products/13614]> Triple Output LED RGB - SMD <https://www.sparkfun.com/products/7844>; PROD_ID: DIO-12986; VALUE: RGB
J1 = con-jack:DCJ0202: DC POWER JACK Source: DCJ0202.pdf; OC_FARNELL: unknown; OC_NEWARK: unknown
J2 = EAGLE-BOARD-TO-BOARD_CONNECTORS-rev16c:621X1021021: WR-PHD 1.27mm Dual SMT Pin Header H=3.80 mm, 10 Pins=>Code : Con_BTB_PHD_1.27_2_621x1021021(Packaging:x = 0: Tube x = 3: Tape & Reel with Cap) <http://katalog.we-online.de/media/thumbs2/eican/thb_Con_BTB_PHD_1.27_2_6210xx21021_pf2.jpg> 6210xx21021 Details see: http://katalog.we-online.de/en/em/621_0xx_210_21 6213xx21021 Details see: http://katalog.we-online.de/en/em/PHD_1_27_SMT_DUAL_PIN_HEADER_REEL_6213XX21021 2014 (C) Würth Elektronik
MUX0 MUX1-MUX3 = micro-philips:PCA9555: 16-bit I2C and SMBus I/O port with interrupt Source: PCA9555_5.pdf; MPN: PCA9555PW; OC_FARNELL: 1408297; OC_NEWARK: 63K6069
N1-N6 = russian-nixies:IN-18: IN-18: large numeric frontview nixie tube
Q1 = transistor-pnp:*-?: PNP Transistor
R1-R6 R15 R16 R21-R49 = resistor:R-EU_: RESISTOR, European symbol
T1-T61 = transistor:*-NPN-: NPN Transistror BF959 corrected 2008.03.06
U1 U3 U4 = _traco_tsr-1:TSR_1-*: TRACO TSR-1 Series Point-of-Load DC/DC-Converters Vi max. 36 V; Vo = (1.2 .. 15)V ±2%; Io = 0 .. 1 A SIP-Package (drop-in replacement for 78xx linear voltage regulators in TO220-package, vertically assembled) Source: www.tracopower.com Technologies: TSR 1- Vi (V) Vo (V) ±2% Io = 0 .. 1 A 24_ ( generic ) 2412 4.6 .. 36 1.2 2415 4.6 .. 36 1.5 2418 4.6 .. 36 1.8 2425 4.6 .. 36 2.5 2433 4.75.. 36 3.3 2450 6.5 .. 36 5.0 2465 9.0 .. 36 6.5 2490 12 .. 36 9.0 24120 15 .. 36 12 24150 18 .. 36 15 Author: Dipl.-Ing. FH Rainer Bayer HHN Hochschule Heilbronn, rainer.bayer@hs-heilbronn.de Ingenieurbüro ing-rb, mail@ing-rb.de
U2 = user_defined:MK64FN1M0VLL12; CPU: ARM Cortex-M4F; FLASHKB: 1024; MANUFACTURER_PART_NUMBER: mk64fn1m0vll12; MAXFREQUENCY: 120; PINCOUNT: 100; SRAMKB: 256; VENDOR: FREESCALE
U$1 = user_defined:NCH6100HV

## Net classes
1 HV: width 0.254 mm, drill 0.254 mm, clearance 0.254 mm to class 0, clearance 0.254 mm